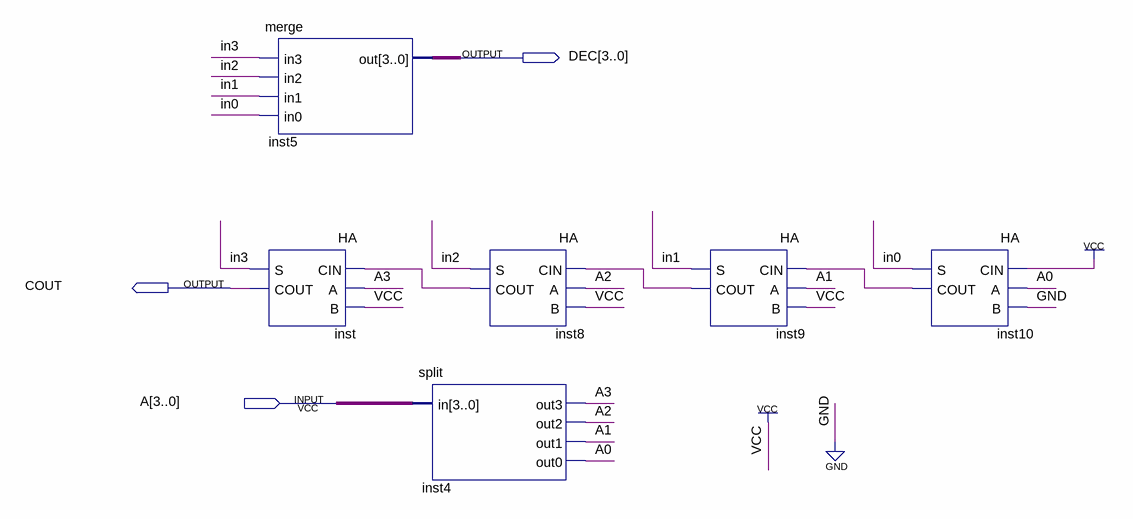
[diagram p0: schematic sheet]
// Quartus schematic DEC.bdf as structural Verilog: 6 symbols, 3 pins
module DEC (
  input  [3:0] A,
  output [3:0] DEC,
  output COUT
);

  wire in0, in1, in2, in3, inst8_cout, inst9_cout, inst10_cout;

  merge inst5 (.in3(in3), .in2(in2), .in1(in1), .in0(in0), .out(DEC));
  HA inst (.CIN(inst8_cout), .A(A[3]), .B(1'b1), .S(in3), .COUT(COUT));
  split inst4 (.in(A), .out3(A[3]), .out2(A[2]), .out1(A[1]), .out0(A[0]));
  HA inst8 (.CIN(inst9_cout), .A(A[2]), .B(1'b1), .S(in2), .COUT(inst8_cout));
  HA inst9 (.CIN(inst10_cout), .A(A[1]), .B(1'b1), .S(in1), .COUT(inst9_cout));
  HA inst10 (.CIN(1'b1), .A(A[0]), .B(1'b0), .S(in0), .COUT(inst10_cout));
endmodule
